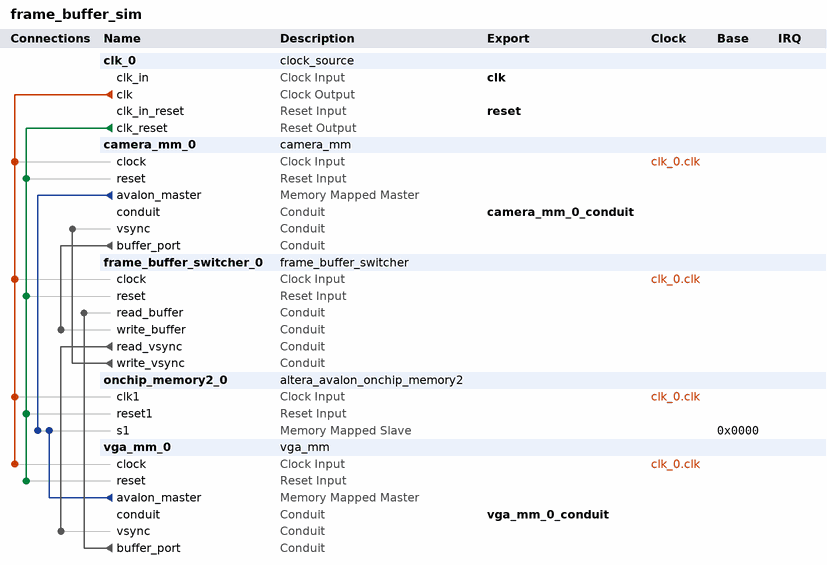
[diagram p0: system contents]
# Platform Designer (Qsys) system frame_buffer_sim, Cyclone IV GX EP4CGX150DF31C7
# Parameters at their usual value, and those the tool derives, are not listed.
package require -exact qsys 15.0
create_system frame_buffer_sim
set_project_property DEVICE_FAMILY {Cyclone IV GX}
set_project_property DEVICE EP4CGX150DF31C7

add_instance clk_0 clock_source 15.0
set_instance_parameter_value clk_0 clockFrequency 50000000

add_instance camera_mm_0 camera_mm 1.0
set_instance_parameter_value camera_mm_0 ADDR_WIDTH 27
set_instance_parameter_value camera_mm_0 DATA_WIDTH 32
set_instance_parameter_value camera_mm_0 FIFO_LENGTH_LOG_2 6
set_instance_parameter_value camera_mm_0 FRAME_PIXELS 307200

add_instance frame_buffer_switcher_0 frame_buffer_switcher 1.0

add_instance onchip_memory2_0 altera_avalon_onchip_memory2 15.0
set_instance_parameter_value onchip_memory2_0 dataWidth 32
set_instance_parameter_value onchip_memory2_0 dualPort false
set_instance_parameter_value onchip_memory2_0 initMemContent true
set_instance_parameter_value onchip_memory2_0 initializationFileName onchip_mem.hex
set_instance_parameter_value onchip_memory2_0 memorySize 1048576

add_instance vga_mm_0 vga_mm 1.0
set_instance_parameter_value vga_mm_0 ADDR_WIDTH 27
set_instance_parameter_value vga_mm_0 BANK 0
set_instance_parameter_value vga_mm_0 DATA_WIDTH 32
set_instance_parameter_value vga_mm_0 FIFO_LENGTH_LOG_2 6
set_instance_parameter_value vga_mm_0 FRAME_PIXELS 307200

# connections
add_connection clk_0.clk camera_mm_0.clock clock
add_connection clk_0.clk frame_buffer_switcher_0.clock clock
add_connection clk_0.clk onchip_memory2_0.clk1 clock
add_connection clk_0.clk vga_mm_0.clock clock
add_connection clk_0.clk_reset camera_mm_0.reset reset
add_connection clk_0.clk_reset frame_buffer_switcher_0.reset reset
add_connection clk_0.clk_reset onchip_memory2_0.reset1 reset
add_connection clk_0.clk_reset vga_mm_0.reset reset
add_connection camera_mm_0.avalon_master onchip_memory2_0.s1 avalon
set_connection_parameter_value camera_mm_0.avalon_master/onchip_memory2_0.s1 baseAddress 0x0000
add_connection vga_mm_0.avalon_master onchip_memory2_0.s1 avalon
set_connection_parameter_value vga_mm_0.avalon_master/onchip_memory2_0.s1 baseAddress 0x0000
add_connection camera_mm_0.buffer_port frame_buffer_switcher_0.write_buffer conduit
add_connection frame_buffer_switcher_0.read_vsync vga_mm_0.vsync conduit
add_connection frame_buffer_switcher_0.write_vsync camera_mm_0.vsync conduit
add_connection vga_mm_0.buffer_port frame_buffer_switcher_0.read_buffer conduit

# exported interfaces
add_interface camera_mm_0_conduit conduit end
set_interface_property camera_mm_0_conduit EXPORT_OF camera_mm_0.conduit
add_interface clk clock sink
set_interface_property clk EXPORT_OF clk_0.clk_in
add_interface reset reset sink
set_interface_property reset EXPORT_OF clk_0.clk_in_reset
add_interface vga_mm_0_conduit conduit end
set_interface_property vga_mm_0_conduit EXPORT_OF vga_mm_0.conduit

set_interconnect_requirement {$system} qsys_mm.clockCrossingAdapter HANDSHAKE
set_interconnect_requirement {$system} qsys_mm.enableEccProtection FALSE
set_interconnect_requirement {$system} qsys_mm.insertDefaultSlave FALSE
set_interconnect_requirement {$system} qsys_mm.maxAdditionalLatency 1

save_system frame_buffer_sim.qsys
